# Altium schematic sheet LPC_Female_FMC.SchDoc: Audio Research: LPC Female FMC Conn
size A4; DrawnBy: Connor Dack; Engineer: Connor Dack; DocumentNumber: 7; Revision: 1.0; SheetNumber: 7; SheetTotal: 20
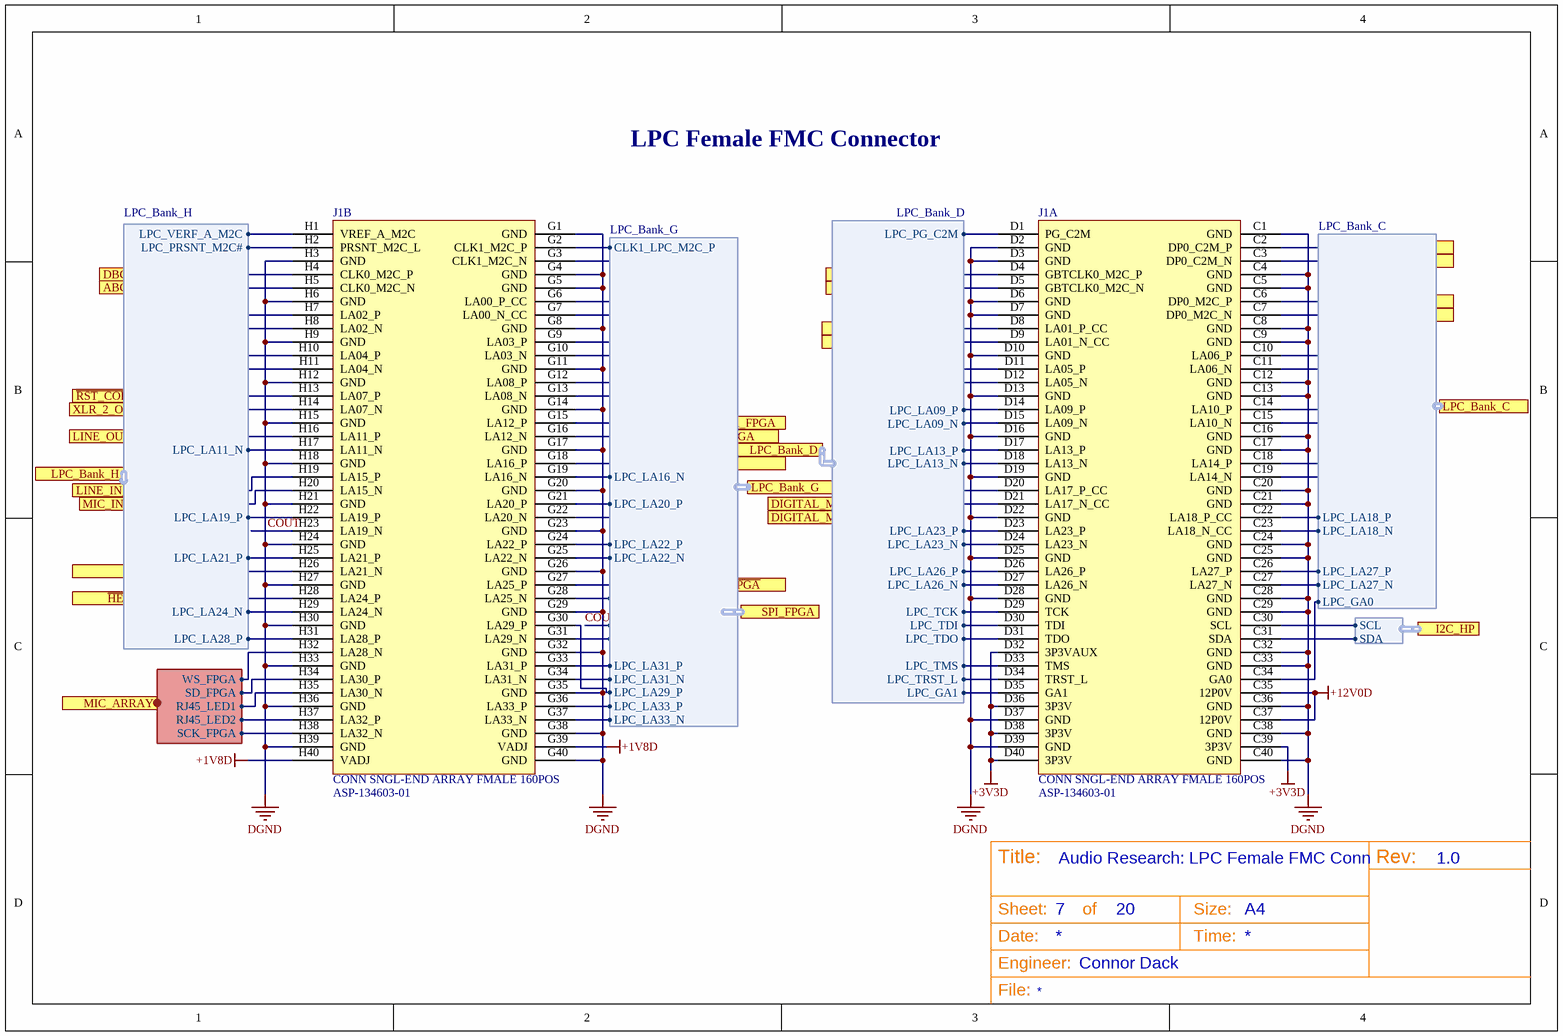
[diagram p0: LPC_Female_FMC.SchDoc]

## Parts
J1  CONN SNGL-END ARRAY FMALE 160POS  [ASP-134603-01]  (parts A,B of 2)

## Ports
ABCLK_FPGA (in), ALRCLK_FPGA (in), CMD_DIR1 (in), CMD_DIR2 (in), DATA_DIR1 (in), DATA_DIR2 (in), DBCLK_FPGA (in), DIGITAL_MIC_CLK (in), DIGITAL_MIC_DATA (in), DLRCLK_FPGA (in), HP_OUT_DSDATA_FPGA (in), I2C_HP (harness I2C), LED1 (in), LED2 (in), LED3 (in), LED4 (in), LINE_IN_DSDATA_FPGA (in), LINE_OUT_DSDATA_FPGA (in), LPC_Bank_C (harness LPC_Bank_C), LPC_Bank_D (harness LPC_Bank_D), LPC_Bank_G (harness LPC_Bank_G), LPC_Bank_H (harness LPC_Bank_H), MCLKO_FPGA (in), MIC_ARRAY (harness Microphone Array), MIC_IN_DSDATA_FPGA (in), MMC0_CLK (in), MMC0_CMD (bidir), MMC0_DAT0 (bidir), MMC0_DAT1 (bidir), MMC0_DAT2 (bidir), MMC0_DAT3 (bidir), MMC0_SDCD (bidir), SPI_FPGA (harness SPI_FPGA), SW1 (in), SW2 (in), SW3 (in), SW4 (in), XLR_1_OUT_DSDATA_FPGA (in), XLR_2_OUT_DSDATA_FPGA (in), ~{CS_AUDIO_CODEC_FPGA} (in), ~{CS_PRE_AMP_FPGA} (in), ~{HEADPHONE_SD_FPGA} (in), ~{RST_CODEC_FPGA} (in)

## Harnesses
LPC_Bank_C: LPC_GA0, LPC_LA18_P, LPC_LA18_N, LPC_LA27_P, LPC_LA27_N
LPC_Bank_D: LPC_PG_C2M, LPC_TCK, LPC_TDI, LPC_TDO, LPC_TMS, LPC_TRST_L, LPC_GA1, LPC_LA13_N, LPC_LA23_P, LPC_LA23_N, LPC_LA26_P, LPC_LA26_N, LPC_LA13_P, LPC_LA09_N, LPC_LA09_P
LPC_Bank_H: LPC_VERF_A_M2C, LPC_PRSNT_M2C#, LPC_LA21_P, LPC_LA24_N, LPC_LA28_P, LPC_LA19_P, LPC_LA11_N
SPI_FPGA: CIN_FPGA, COUT_FPGA, CCLK_FPGA
Microphone Array: SD_FPGA, SCK_FPGA, WS_FPGA, RJ45_LED1, RJ45_LED2
I2C: SDA, SCL
LPC_Bank_G: CLK1_LPC_M2C_P, LPC_LA20_P, LPC_LA22_P, LPC_LA22_N, LPC_LA31_P, LPC_LA31_N, LPC_LA33_P, LPC_LA33_N, LPC_LA29_P, LPC_LA16_N

## Nets
+1V8D: J1.G39(VADJ) J1.H40(VADJ)
+3V3D: J1.C39(3P3V) J1.D32(3P3VAUX) J1.D36(3P3V) J1.D38(3P3V) J1.D40(3P3V)
+12V0D: J1.C10(LA06_P) J1.C11(LA06_N) J1.C35(12P0V) J1.C37(12P0V) J1.D11(LA05_P) J1.D12(LA05_N) J1.G12(LA08_P) J1.G13(LA08_N) J1.H11(LA04_N)
DGND: J1.C1(GND) J1.C4(GND) J1.C5(GND) J1.C8(GND) J1.C9(GND) J1.C12(GND) J1.C13(GND) J1.C16(GND) J1.C17(GND) J1.C20(GND) J1.C21(GND) J1.C24(GND) J1.C25(GND) J1.C28(GND) J1.C29(GND) J1.C32(GND) J1.C33(GND) J1.C36(GND) J1.C38(GND) J1.C40(GND) J1.D2(GND) J1.D3(GND) J1.D6(GND) J1.D7(GND) J1.D10(GND) J1.D13(GND) J1.D16(GND) J1.D19(GND) J1.D22(GND) J1.D25(GND) J1.D28(GND) J1.D37(GND) J1.D39(GND) J1.G1(GND) J1.G4(GND) J1.G5(GND) J1.G8(GND) J1.G11(GND) J1.G14(GND) J1.G17(GND) J1.G20(GND) J1.G23(GND) J1.G26(GND) J1.G29(GND) J1.G32(GND) J1.G35(GND) J1.G38(GND) J1.G40(GND) J1.H3(GND) J1.H6(GND) J1.H9(GND) J1.H12(GND) J1.H15(GND) J1.H18(GND) J1.H21(GND) J1.H24(GND) J1.H27(GND) J1.H30(GND) J1.H33(GND) J1.H36(GND) J1.H39(GND)
~{RST_CODEC_FPGA}: J1.H13(LA07_P) ; port ~{RST_CODEC_FPGA}
ABCLK_FPGA: J1.H5(CLK0_M2C_N) ; port ABCLK_FPGA
ALRCLK_FPGA: J1.G22(LA20_N) ; port ALRCLK_FPGA
~{CS_AUDIO_CODEC_FPGA}: J1.G27(LA25_P) ; port ~{CS_AUDIO_CODEC_FPGA}
~{CS_PRE_AMP_FPGA}: J1.H26(LA21_N) ; port ~{CS_PRE_AMP_FPGA}
CMD_DIR1: J1.C19(LA14_N) ; port CMD_DIR1
CMD_DIR2: J1.C18(LA14_P) ; port CMD_DIR2
COUT: J1.H23(LA19_N) ; port SPI_FPGA.COUT_FPGA
DATA_DIR1: J1.C15(LA10_N) ; port DATA_DIR1
DATA_DIR2: J1.C14(LA10_P) ; port DATA_DIR2
DBCLK_FPGA: J1.H4(CLK0_M2C_P) ; port DBCLK_FPGA
DIGITAL_MIC_CLK: J1.D20(LA17_P_CC) ; port DIGITAL_MIC_CLK
DIGITAL_MIC_DATA: J1.D21(LA17_N_CC) ; port DIGITAL_MIC_DATA
DLRCLK_FPGA: J1.G18(LA16_P) ; port DLRCLK_FPGA
~{HEADPHONE_SD_FPGA}: J1.H28(LA24_P) ; port ~{HEADPHONE_SD_FPGA}
HP_OUT_DSDATA_FPGA: J1.G16(LA12_N) ; port HP_OUT_DSDATA_FPGA
LED1: J1.C7(DP0_M2C_N) ; port LED1
LED2: J1.D8(LA01_P_CC) ; port LED2
LED3: J1.D9(LA01_N_CC) ; port LED3
LED4: J1.C6(DP0_M2C_P) ; port LED4
LINE_IN_DSDATA_FPGA: J1.H19(LA15_P) ; port LINE_IN_DSDATA_FPGA
LINE_OUT_DSDATA_FPGA: J1.H16(LA11_P) ; port LINE_OUT_DSDATA_FPGA
MCLKO_FPGA: J1.G3(CLK1_M2C_N) ; port MCLKO_FPGA
MIC_IN_DSDATA_FPGA: J1.H20(LA15_N) ; port MIC_IN_DSDATA_FPGA
MMC0_CLK: J1.G7(LA00_N_CC) ; port MMC0_CLK
MMC0_CMD: J1.G9(LA03_P) ; port MMC0_CMD
MMC0_DAT0: J1.G10(LA03_N) ; port MMC0_DAT0
MMC0_DAT1: J1.H10(LA04_P) ; port MMC0_DAT1
MMC0_DAT2: J1.H7(LA02_P) ; port MMC0_DAT2
MMC0_DAT3: J1.H8(LA02_N) ; port MMC0_DAT3
MMC0_SDCD: J1.G6(LA00_P_CC) ; port MMC0_SDCD
SW1: J1.C2(DP0_C2M_P) ; port SW1
SW2: J1.C3(DP0_C2M_N) ; port SW2
SW3: J1.D4(GBTCLK0_M2C_P) ; port SW3
SW4: J1.D5(GBTCLK0_M2C_N) ; port SW4
XLR_1_OUT_DSDATA_FPGA: J1.G15(LA12_P) ; port XLR_1_OUT_DSDATA_FPGA
XLR_2_OUT_DSDATA_FPGA: J1.H14(LA07_N) ; port XLR_2_OUT_DSDATA_FPGA
NetJ1_C22: J1.C22(LA18_P_CC) ; port LPC_Bank_C.LPC_LA18_P
NetJ1_C23: J1.C23(LA18_N_CC) ; port LPC_Bank_C.LPC_LA18_N
NetJ1_C26: J1.C26(LA27_P) ; port LPC_Bank_C.LPC_LA27_P
NetJ1_C27: J1.C27(LA27_N) ; port LPC_Bank_C.LPC_LA27_N
NetJ1_C30: J1.C30(SCL) ; port I2C_HP.SCL
NetJ1_C31: J1.C31(SDA) ; port I2C_HP.SDA
NetJ1_C34: J1.C34(GA0) ; port LPC_Bank_C.LPC_GA0
NetJ1_D1: J1.D1(PG_C2M) ; port LPC_Bank_D.LPC_PG_C2M
NetJ1_D14: J1.D14(LA09_P) ; port LPC_Bank_D.LPC_LA09_P
NetJ1_D15: J1.D15(LA09_N) ; port LPC_Bank_D.LPC_LA09_N
NetJ1_D17: J1.D17(LA13_P) ; port LPC_Bank_D.LPC_LA13_P
NetJ1_D18: J1.D18(LA13_N) ; port LPC_Bank_D.LPC_LA13_N
NetJ1_D23: J1.D23(LA23_P) ; port LPC_Bank_D.LPC_LA23_P
NetJ1_D24: J1.D24(LA23_N) ; port LPC_Bank_D.LPC_LA23_N
NetJ1_D26: J1.D26(LA26_P) ; port LPC_Bank_D.LPC_LA26_P
NetJ1_D27: J1.D27(LA26_N) ; port LPC_Bank_D.LPC_LA26_N
NetJ1_D29: J1.D29(TCK) ; port LPC_Bank_D.LPC_TCK
NetJ1_D30: J1.D30(TDI) ; port LPC_Bank_D.LPC_TDI
NetJ1_D31: J1.D31(TDO) ; port LPC_Bank_D.LPC_TDO
NetJ1_D33: J1.D33(TMS) ; port LPC_Bank_D.LPC_TMS
NetJ1_D34: J1.D34(TRST_L) ; port LPC_Bank_D.LPC_TRST_L
NetJ1_D35: J1.D35(GA1) ; port LPC_Bank_D.LPC_GA1
NetJ1_G2: J1.G2(CLK1_M2C_P) ; port LPC_Bank_G.CLK1_LPC_M2C_P
NetJ1_G19: J1.G19(LA16_N) ; port LPC_Bank_G.LPC_LA16_N
NetJ1_G21: J1.G21(LA20_P) ; port LPC_Bank_G.LPC_LA20_P
NetJ1_G24: J1.G24(LA22_P) ; port LPC_Bank_G.LPC_LA22_P
NetJ1_G25: J1.G25(LA22_N) ; port LPC_Bank_G.LPC_LA22_N
NetJ1_G28: J1.G28(LA25_N) ; port SPI_FPGA.CIN_FPGA
NetJ1_G30: J1.G30(LA29_P) ; port LPC_Bank_G.LPC_LA29_P
NetJ1_G31: J1.G31(LA29_N) ; port SPI_FPGA.CCLK_FPGA
NetJ1_G33: J1.G33(LA31_P) ; port LPC_Bank_G.LPC_LA31_P
NetJ1_G34: J1.G34(LA31_N) ; port LPC_Bank_G.LPC_LA31_N
NetJ1_G36: J1.G36(LA33_P) ; port LPC_Bank_G.LPC_LA33_P
NetJ1_G37: J1.G37(LA33_N) ; port LPC_Bank_G.LPC_LA33_N
NetJ1_H1: J1.H1(VREF_A_M2C) ; port LPC_Bank_H.LPC_VERF_A_M2C
NetJ1_H2: J1.H2(PRSNT_M2C_L) ; port LPC_Bank_H.LPC_PRSNT_M2C#
NetJ1_H17: J1.H17(LA11_N) ; port LPC_Bank_H.LPC_LA11_N
NetJ1_H22: J1.H22(LA19_P) ; port LPC_Bank_H.LPC_LA19_P
NetJ1_H25: J1.H25(LA21_P) ; port LPC_Bank_H.LPC_LA21_P
NetJ1_H29: J1.H29(LA24_N) ; port LPC_Bank_H.LPC_LA24_N
NetJ1_H31: J1.H31(LA28_P) ; port LPC_Bank_H.LPC_LA28_P
NetJ1_H32: J1.H32(LA28_N) ; port MIC_ARRAY.WS_FPGA
NetJ1_H34: J1.H34(LA30_P) ; port MIC_ARRAY.SD_FPGA
NetJ1_H35: J1.H35(LA30_N) ; port MIC_ARRAY.RJ45_LED1
NetJ1_H37: J1.H37(LA32_P) ; port MIC_ARRAY.RJ45_LED2
NetJ1_H38: J1.H38(LA32_N) ; port MIC_ARRAY.SCK_FPGA

## Notes on the sheet
- LPC Female FMC Connector
- Title:
- Sheet:
- of
- Size:
- A4
- Rev:
- Date:
- Engineer:
- Time:
- File:

## Library data of the parts
J1 = ASP-134603-01: Low Pin Count Female FPGA Mezzanine Card Connector; Manufacturer: Samtec; Number of Positions: 160; Gender: Receptacle; Pitch: 1.27mm; Load Status: DNI; Supplier 1: Digi-Key; Stock 1: 418; Pricing 1: 1=12.68, 10=12.253, 25=11.83, 50=11.4076, 100=10.985, 250=10.7738, 500=10.5625 (USD); Mount: Surface Mount; Contact Plating: Nickel,Gold; Contact Material: Copper Alloy; Housing Colour: Black; Number of Rows: 4; Packaging: Tape and Reel; Termination: Solder; Number of Contacts: 160; Orientation: Straight; Depth: 13.23mm; Radiation Hardening: No; REACH SVHC: No SVHC; ComponentLink1URL: https://datasheet.ciiva.com/403/asp-134603-01-403748.pdf; ComponentLink1Description: https://datasheet.ciiva.com/403/asp-134603-01-403748.pdf; ComponentLink2URL: https://datasheet.ciiva.com/26877/getdatasheetpartid-748375-26877304.pdf; ComponentLink2Description: https://datasheet.ciiva.com/26877/getdatasheetpartid-748375-26877304.pdf; Supplier Part Number 1: SAM8729-ND; Manufacturer Part Number: ASP-134603-01